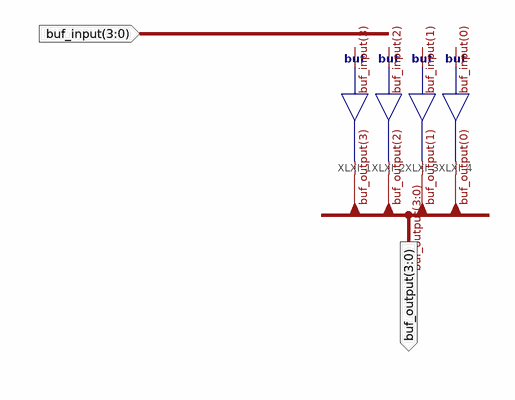
[diagram p0: schematic sheet 1]
// Xilinx ISE schematic four_bit_buffer.sch (artix7) as structural Verilog: 4 symbols, 2 ports
module four_bit_buffer (
  input  [3:0] buf_input,
  output [3:0] buf_output
);

  buf XLXI_1 (buf_output[3], buf_input[3]);
  buf XLXI_2 (buf_output[2], buf_input[2]);
  buf XLXI_3 (buf_output[1], buf_input[1]);
  buf XLXI_4 (buf_output[0], buf_input[0]);
endmodule
